# Altium schematic sheet lin_reg.SchDoc: =GlobalProjectName
size 209 x 297 mm; ApprovedBy: Утвердил; CheckedBy: Проверил; Author: Разработал; SheetNumber: 5; SheetTotal: 7; PageSetup: Record=PageOptions|CenterHorizontal=True|CenterVertical=True|PrintScale=1.00|XCorrection=1.00|YCorrection=1.00|PrintKind=1|BorderSize=5000000|LeftOffset=0|BottomOffset=0|Orientation=2|PaperLength=1000|PaperWidth=1000|Scale=100|PaperSource=15|PrintQuality=1200|MediaType=1|DitherType=10|PaperKind=A3|PrintScaleMode=1; Weight: -; ScaleFactor: -; NormInspection: Норм.Контр.
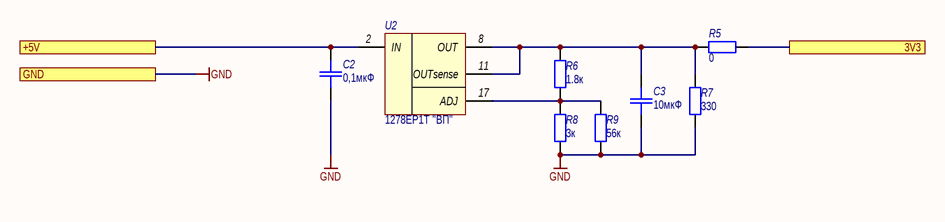
[diagram p0: lin_reg.SchDoc]

## Parts
C2  0,1мкФ  [SMD_0805]
C3  10мкФ  [SMD_0805]
R5  0  [SMD_0805]
R6  1.8к  [SMD_0805]
R7  330  [SMD_0805]
R8  3к  [SMD_0805]
R9  56к  [SMD_0805]
U2  Наименование: 1278ЕР1Т "ВП"  [4116.4-3_offcut]  (hidden comment: 1278ER1T VP)

## Ports
3V3, +5V, GND

## Nets
GND: C2.1 C3.1 R7.1 R8.1 R9.1 ; port GND
3V3: R5.1 ; port 3V3
+5V: C2.2 U2.2(IN) ; port +5V
NetC3_2: C3.2 R5.2 R6.2 R7.2 U2.8(OUT) U2.11(OUTsense)
NetR6_1: R6.1 R8.2 R9.2 U2.17(ADJ)

## Notes on the sheet
- Подп. и дата
- Инв. № дубл.
- Взам. инв. №
- Инв. № подл.
- Изм.
- Лист
- № докум.
- Подп.
- Дата
- Форма 2а ГОСТ 2.104-2006
- Копировал
- Формат А4

## Library data of the parts
C2 C3 = Capacitor: Назначение: SMD-конденсатор; Наименование: К10-79 МП0 «ВП»; Потребление, Вт: 0
  C2: Value: 0,1мкФ
  C3: Value: 10мкФ
R5-R9 = Resistor: Наименование: Р1-12-0.125 ОСМ; Назначение: SMD-резистор; Потребление, Вт: 0,001
  R5: Value: 0
  R6: Value: 1.8к
  R7: Value: 330
  R8: Value: 3к
  R9: Value: 56к
U2 = 1278ER1T: Low-drop linear regulator; Назначение: Линейный регулятор; Потребление, Вт: 0,100; ComponentLink1Description: DataSheet; ComponentLink1URL: https://www.radiant.su/files/images/Kremhij-marketing/1278EP1T.pdf